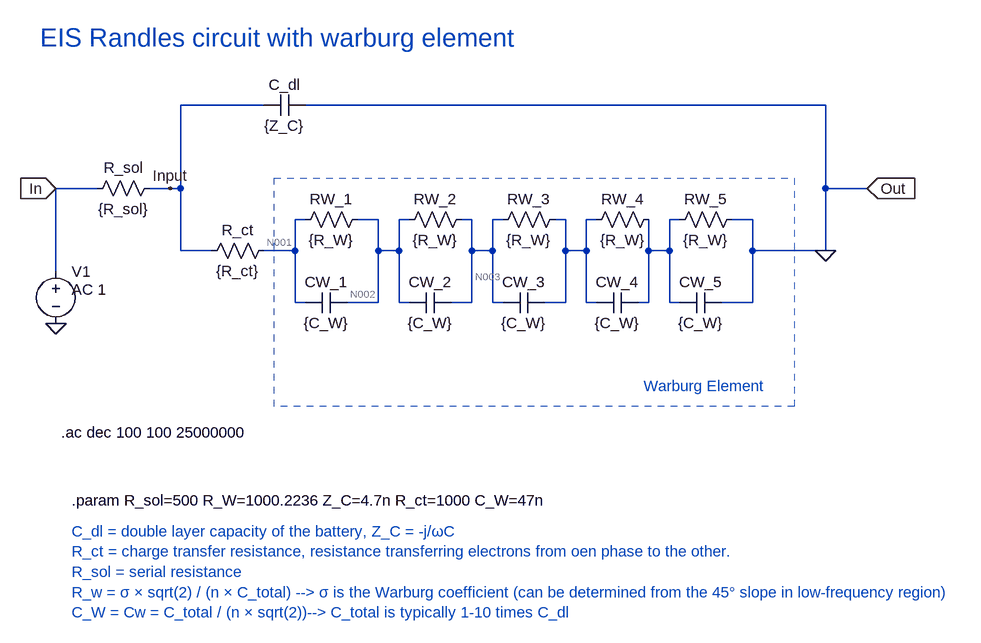
[diagram p0: schematic Warbrug element 5 stage.asc]
Warbrug element 5 stage.asc, the LTspice schematic file:
Version 4
SHEET 1 1704 800
WIRE 480 16 352 16
WIRE 1344 16 544 16
WIRE 224 144 160 144
WIRE 336 144 304 144
WIRE 352 144 352 16
WIRE 352 144 336 144
WIRE 1344 144 1344 16
WIRE 1408 144 1344 144
WIRE 544 192 528 192
WIRE 656 192 624 192
WIRE 704 192 688 192
WIRE 800 192 784 192
WIRE 848 192 832 192
WIRE 944 192 928 192
WIRE 992 192 976 192
WIRE 1120 192 1104 192
WIRE 1232 192 1200 192
WIRE 352 240 352 144
WIRE 400 240 352 240
WIRE 528 240 528 192
WIRE 528 240 480 240
WIRE 656 240 656 192
WIRE 688 240 688 192
WIRE 688 240 656 240
WIRE 800 240 800 192
WIRE 832 240 832 192
WIRE 832 240 800 240
WIRE 944 240 944 192
WIRE 976 240 976 192
WIRE 976 240 944 240
WIRE 1072 240 1072 192
WIRE 1104 240 1104 192
WIRE 1104 240 1072 240
WIRE 1232 240 1232 192
WIRE 1344 240 1344 144
WIRE 1344 240 1232 240
WIRE 160 272 160 144
WIRE 528 320 528 240
WIRE 544 320 528 320
WIRE 656 320 656 240
WIRE 656 320 608 320
WIRE 688 320 688 240
WIRE 704 320 688 320
WIRE 800 320 800 240
WIRE 800 320 768 320
WIRE 832 320 832 240
WIRE 848 320 832 320
WIRE 944 320 944 240
WIRE 944 320 912 320
WIRE 976 320 976 240
WIRE 992 320 976 320
WIRE 1072 320 1072 240
WIRE 1072 320 1056 320
WIRE 1104 320 1104 240
WIRE 1120 320 1104 320
WIRE 1232 320 1232 240
WIRE 1232 320 1184 320
FLAG 160 144 In
IOPIN 160 144 In
FLAG 1408 144 Out
IOPIN 1408 144 In
FLAG 160 352 0
FLAG 1344 240 0
FLAG 336 144 Input
SYMBOL res 320 128 R90
WINDOW 0 0 56 VBottom 2
WINDOW 3 32 56 VTop 2
SYMATTR InstName R_sol
SYMATTR Value {R_sol}
SYMBOL res 496 224 R90
WINDOW 0 0 56 VBottom 2
WINDOW 3 32 56 VTop 2
SYMATTR InstName R_ct
SYMATTR Value {R_ct}
SYMBOL cap 544 0 R90
WINDOW 0 0 32 VBottom 2
WINDOW 3 32 32 VTop 2
SYMATTR InstName C_dl
SYMATTR Value {Z_C}
SYMBOL res 640 176 R90
WINDOW 0 0 56 VBottom 2
WINDOW 3 32 56 VTop 2
SYMATTR InstName RW_1
SYMATTR Value {R_W}
SYMBOL res 800 176 R90
WINDOW 0 0 56 VBottom 2
WINDOW 3 32 56 VTop 2
SYMATTR InstName RW_2
SYMATTR Value {R_W}
SYMBOL res 944 176 R90
WINDOW 0 0 56 VBottom 2
WINDOW 3 32 56 VTop 2
SYMATTR InstName RW_3
SYMATTR Value {R_W}
SYMBOL res 1088 176 R90
WINDOW 0 0 56 VBottom 2
WINDOW 3 32 56 VTop 2
SYMATTR InstName RW_4
SYMATTR Value {R_W}
SYMBOL res 1216 176 R90
WINDOW 0 0 56 VBottom 2
WINDOW 3 32 56 VTop 2
SYMATTR InstName RW_5
SYMATTR Value {R_W}
SYMBOL cap 608 304 R90
WINDOW 0 0 32 VBottom 2
WINDOW 3 32 32 VTop 2
SYMATTR InstName CW_1
SYMATTR Value {C_W}
SYMBOL cap 768 304 R90
WINDOW 0 0 32 VBottom 2
WINDOW 3 32 32 VTop 2
SYMATTR InstName CW_2
SYMATTR Value {C_W}
SYMBOL cap 912 304 R90
WINDOW 0 0 32 VBottom 2
WINDOW 3 32 32 VTop 2
SYMATTR InstName CW_3
SYMATTR Value {C_W}
SYMBOL cap 1056 304 R90
WINDOW 0 0 32 VBottom 2
WINDOW 3 32 32 VTop 2
SYMATTR InstName CW_4
SYMATTR Value {C_W}
SYMBOL cap 1184 304 R90
WINDOW 0 0 32 VBottom 2
WINDOW 3 32 32 VTop 2
SYMATTR InstName CW_5
SYMATTR Value {C_W}
SYMBOL voltage 160 256 R0
WINDOW 123 24 44 Left 2
WINDOW 39 0 0 Left 0
SYMATTR Value2 AC 1
SYMATTR InstName V1
SYMATTR Value ""
TEXT 184 672 Left 2 ;C_dl = double layer capacity of the battery, Z_C = -j/ωC\nR_ct = charge transfer resistance, resistance transferring electrons from oen phase to the other.\nR_sol = serial resistance\nR_w = σ × sqrt(2) / (n × C_total) --> σ is the Warburg coefficient (can be determined from the 45° slope in low-frequency region)\nC_W = Cw = C_total / (n × sqrt(2))--> C_total is typically 1-10 times C_dl
TEXT 136 -88 Left 4 ;EIS Randles circuit with warburg element
TEXT 184 624 Left 2 !.param R_sol=500 R_W=1000.2236 Z_C=4.7n R_ct=1000 C_W=47n
TEXT 1064 448 Left 2 ;Warburg Element
TEXT 168 520 Left 2 !.ac dec 100 100 25000000
RECTANGLE Normal 1296 480 496 128 2

The netlist it stands for:
* Warbrug element 5 stage.asc
R_sol Input In {R_sol}
R_ct N001 Input {R_ct}
C_dl 0 Input {Z_C}
RW_1 N002 N001 {R_W}
RW_2 N003 N002 {R_W}
RW_3 N004 N003 {R_W}
RW_4 N005 N004 {R_W}
RW_5 0 N005 {R_W}
CW_1 N002 N001 {C_W}
CW_2 N003 N002 {C_W}
CW_3 N004 N003 {C_W}
CW_4 N005 N004 {C_W}
CW_5 0 N005 {C_W}
V1 In 0 AC 1
* C_dl = double layer capacity of the battery, Z_C = -j/ωC
* R_ct = charge transfer resistance, resistance transferring electrons from oen phase to the other.
* R_sol = serial resistance
* R_w = σ × sqrt(2) / (n × C_total) --> σ is the Warburg coefficient (can be determined from the 45° slope in low-frequency region)
* C_W = Cw = C_total / (n × sqrt(2))--> C_total is typically 1-10 times C_dl
* EIS Randles circuit with warburg element
.param R_sol=500 R_W=1000.2236 Z_C=4.7n R_ct=1000 C_W=47n
* Warburg Element
.ac dec 100 100 25000000
.backanno
.end

* Results of the author's LTspice run, read from the files saved beside the schematic
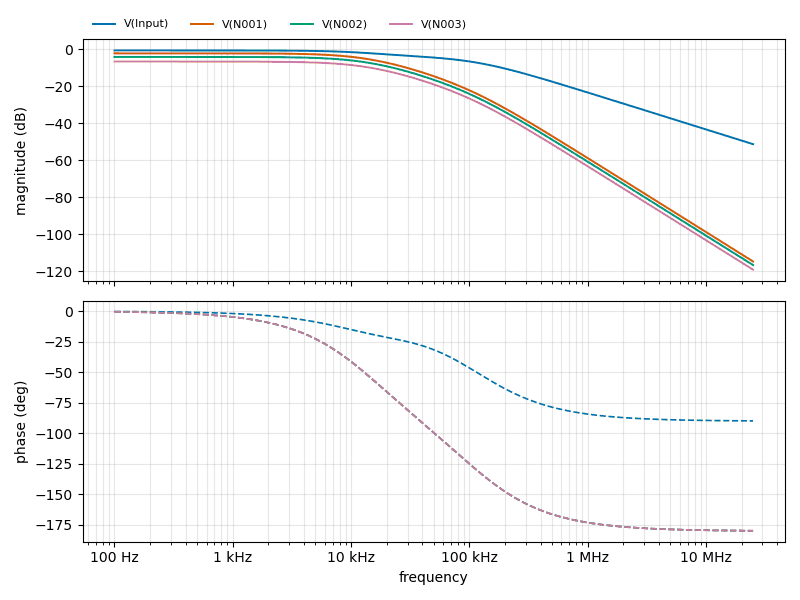
[diagram p1: AC Analysis of Warbrug element 5 stage.asc, plotted from the saved traces]
* AC Analysis, 1 run:
*   V(Input): -0.70 dB at 100 Hz, -51.34 dB at 25 MHz, peak -0.70 dB at 100 Hz, 3 dB below the peak at 32.16 kHz
*   V(N001): -2.28 dB at 100 Hz, -114.73 dB at 25 MHz, peak -2.28 dB at 100 Hz, 3 dB below the peak at 13.57 kHz
*   V(N002): -4.22 dB at 100 Hz, -116.67 dB at 25 MHz, peak -4.22 dB at 100 Hz, 3 dB below the peak at 13.57 kHz
*   V(N003): -6.72 dB at 100 Hz, -119.17 dB at 25 MHz, peak -6.72 dB at 100 Hz, 3 dB below the peak at 13.57 kHz